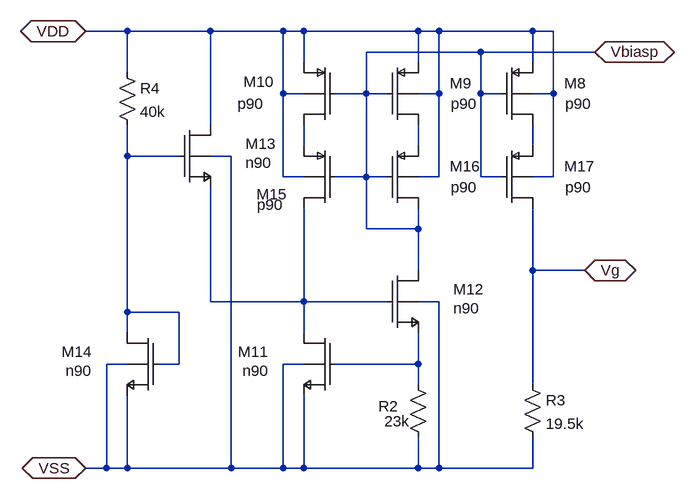
[diagram p0: schematic bias.asc]
bias.asc, the LTspice schematic file:
Version 4
SHEET 1 880 1184
WIRE -1280 336 -1344 336
WIRE -1152 336 -1280 336
WIRE -1040 336 -1152 336
WIRE -1008 336 -1040 336
WIRE -832 336 -1008 336
WIRE -800 336 -832 336
WIRE -656 336 -800 336
WIRE -624 336 -656 336
WIRE -736 368 -912 368
WIRE -560 368 -736 368
WIRE -1008 384 -1008 336
WIRE -832 384 -832 336
WIRE -656 384 -656 336
WIRE -1280 400 -1280 336
WIRE -1040 432 -1040 336
WIRE -1008 432 -1040 432
WIRE -912 432 -912 368
WIRE -912 432 -960 432
WIRE -880 432 -912 432
WIRE -800 432 -800 336
WIRE -800 432 -832 432
WIRE -736 432 -736 368
WIRE -704 432 -736 432
WIRE -624 432 -624 336
WIRE -624 432 -656 432
WIRE -1152 480 -1152 336
WIRE -1008 512 -1008 480
WIRE -832 512 -832 480
WIRE -656 512 -656 480
WIRE -1280 528 -1280 480
WIRE -1200 528 -1280 528
WIRE -1120 528 -1152 528
WIRE -1040 560 -1040 432
WIRE -1008 560 -1040 560
WIRE -912 560 -912 432
WIRE -912 560 -960 560
WIRE -880 560 -912 560
WIRE -800 560 -800 432
WIRE -800 560 -832 560
WIRE -736 560 -736 432
WIRE -704 560 -736 560
WIRE -624 560 -624 432
WIRE -624 560 -656 560
WIRE -912 640 -912 560
WIRE -832 640 -832 608
WIRE -832 640 -912 640
WIRE -832 704 -832 640
WIRE -656 704 -656 608
WIRE -576 704 -656 704
WIRE -1152 752 -1152 576
WIRE -1008 752 -1008 608
WIRE -1008 752 -1152 752
WIRE -880 752 -1008 752
WIRE -800 752 -832 752
WIRE -1280 768 -1280 528
WIRE -1200 768 -1280 768
WIRE -1280 800 -1280 768
WIRE -1008 800 -1008 752
WIRE -1280 848 -1312 848
WIRE -1200 848 -1200 768
WIRE -1200 848 -1232 848
WIRE -1008 848 -1040 848
WIRE -832 848 -832 800
WIRE -832 848 -960 848
WIRE -832 880 -832 848
WIRE -656 880 -656 704
WIRE -1312 1008 -1312 848
WIRE -1312 1008 -1344 1008
WIRE -1280 1008 -1280 896
WIRE -1280 1008 -1312 1008
WIRE -1120 1008 -1120 528
WIRE -1120 1008 -1280 1008
WIRE -1040 1008 -1040 848
WIRE -1040 1008 -1120 1008
WIRE -1008 1008 -1008 896
WIRE -1008 1008 -1040 1008
WIRE -832 1008 -832 960
WIRE -832 1008 -1008 1008
WIRE -800 1008 -800 752
WIRE -800 1008 -832 1008
WIRE -656 1008 -656 960
WIRE -656 1008 -800 1008
FLAG -1344 336 VDD
IOPIN -1344 336 BiDir
FLAG -1344 1008 VSS
IOPIN -1344 1008 BiDir
FLAG -560 368 Vbiasp
IOPIN -560 368 BiDir
FLAG -576 704 Vg
IOPIN -576 704 BiDir
SYMBOL pmosb -880 384 R0
WINDOW 0 97 32 Left 0
WINDOW 3 98 64 Left 0
SYMATTR InstName M9
SYMATTR Value p90
SYMATTR Value2 l=0.5u w=6.6u m=1
SYMBOL pmosb -960 384 M0
WINDOW 0 94 30 Left 0
WINDOW 3 110 64 Left 0
SYMATTR InstName M10
SYMATTR Value p90
SYMATTR Value2 l=0.5u w=6.6u m=1
SYMBOL nmosb -880 704 R0
WINDOW 0 102 29 Left 0
WINDOW 3 102 58 Left 0
WINDOW 39 65 55 Left 0
SYMATTR InstName M12
SYMATTR Value n90
SYMATTR Value2 l=0.5u w=2u m=1
SYMBOL nmosb -960 800 M0
WINDOW 0 102 29 Left 0
WINDOW 3 102 58 Left 0
WINDOW 39 65 55 Left 0
SYMATTR InstName M11
SYMATTR Value n90
SYMATTR Value2 l=0.5u w=2u m=1
SYMBOL res -848 864 R0
WINDOW 0 -45 49 Left 0
WINDOW 3 -36 72 Left 0
SYMATTR InstName R2
SYMATTR Value 23k
SYMBOL pmosb -704 384 R0
WINDOW 0 97 32 Left 0
WINDOW 3 98 64 Left 0
SYMATTR InstName M8
SYMATTR Value p90
SYMATTR Value2 l=0.5u w=6.6u m=1
SYMBOL res -672 864 R0
SYMATTR InstName R3
SYMATTR Value 19.5k
SYMBOL nmosb -1200 480 R0
WINDOW 0 102 29 Left 0
WINDOW 3 102 58 Left 0
WINDOW 39 65 55 Left 0
SYMATTR InstName M13
SYMATTR Value n90
SYMATTR Value2 l=0.5u w=1u m=1
SYMBOL res -1296 384 R0
SYMATTR InstName R4
SYMATTR Value 40k
SYMBOL nmosb -1232 800 M0
WINDOW 0 102 29 Left 0
WINDOW 3 102 58 Left 0
WINDOW 39 65 55 Left 0
SYMATTR InstName M14
SYMATTR Value n90
SYMATTR Value2 l=0.5u w=3u m=1
SYMBOL pmosb -960 512 M0
WINDOW 0 74 75 Left 0
WINDOW 3 80 91 Left 0
SYMATTR InstName M15
SYMATTR Value p90
SYMATTR Value2 l=0.25u w=33u m=1
SYMBOL pmosb -880 512 R0
WINDOW 0 97 32 Left 0
WINDOW 3 98 64 Left 0
SYMATTR InstName M16
SYMATTR Value p90
SYMATTR Value2 l=0.25u w=33u m=1
SYMBOL pmosb -704 512 R0
WINDOW 0 97 32 Left 0
WINDOW 3 98 64 Left 0
SYMATTR InstName M17
SYMATTR Value p90
SYMATTR Value2 l=0.25u w=33u m=1

The netlist it stands for:
* bias.asc
M9 N002 Vbiasp VDD VDD p90 l=0.5u w=6.6u m=1
M10 N001 Vbiasp VDD VDD p90 l=0.5u w=6.6u m=1
M12 Vbiasp N005 N006 VSS n90 l=0.5u w=2u m=1
M11 N005 N006 VSS VSS n90 l=0.5u w=2u m=1
R2 N006 VSS 23k
M8 N003 Vbiasp VDD VDD p90 l=0.5u w=6.6u m=1
R3 Vg VSS 19.5k
M13 VDD N004 N005 VSS n90 l=0.5u w=1u m=1
R4 VDD N004 40k
M14 N004 N004 VSS VSS n90 l=0.5u w=3u m=1
M15 N005 Vbiasp N001 VDD p90 l=0.25u w=33u m=1
M16 Vbiasp Vbiasp N002 VDD p90 l=0.25u w=33u m=1
M17 Vg Vbiasp N003 VDD p90 l=0.25u w=33u m=1
.model NMOS NMOS
.model PMOS PMOS
.lib standard.mos
.backanno
.end